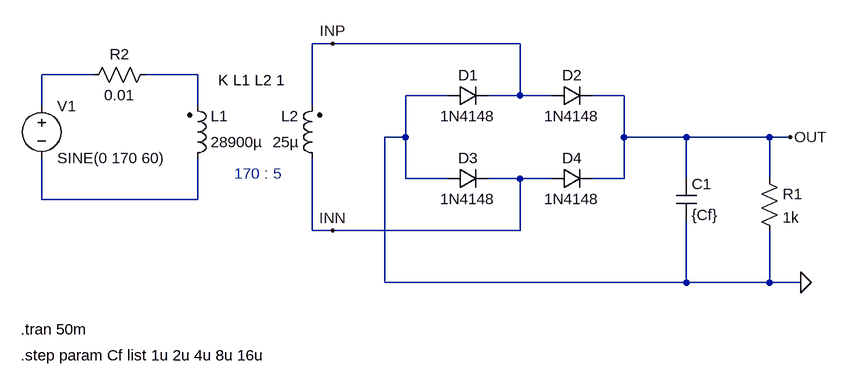
[diagram p0: schematic rectifier_fullwave_tran.asc]
rectifier_fullwave_tran.asc, the LTspice schematic file:
Version 4
SHEET 1 880 680
WIRE 64 -48 32 -48
WIRE 352 -48 64 -48
WIRE -304 0 -384 0
WIRE -144 0 -224 0
WIRE 240 32 176 32
WIRE 352 32 352 -48
WIRE 352 32 304 32
WIRE 400 32 352 32
WIRE 512 32 464 32
WIRE -384 48 -384 0
WIRE -144 48 -144 0
WIRE 32 48 32 -48
WIRE 176 96 176 32
WIRE 176 96 144 96
WIRE 512 96 512 32
WIRE 608 96 512 96
WIRE 736 96 608 96
WIRE 768 96 736 96
WIRE 176 160 176 96
WIRE 240 160 176 160
WIRE 352 160 304 160
WIRE 400 160 352 160
WIRE 512 160 512 96
WIRE 512 160 464 160
WIRE 608 160 608 96
WIRE 736 160 736 96
WIRE -384 192 -384 128
WIRE -144 192 -144 128
WIRE -144 192 -384 192
WIRE 32 240 32 128
WIRE 64 240 32 240
WIRE 352 240 352 160
WIRE 352 240 64 240
WIRE 144 320 144 96
WIRE 608 320 608 224
WIRE 608 320 144 320
WIRE 736 320 736 240
WIRE 736 320 608 320
WIRE 784 320 736 320
FLAG 784 320 0
FLAG 768 96 OUT
FLAG 64 -48 INP
FLAG 64 240 INN
SYMBOL voltage -384 32 R0
WINDOW 123 0 0 Left 0
WINDOW 39 0 0 Left 0
SYMATTR InstName V1
SYMATTR Value SINE(0 170 60)
SYMBOL diode 240 48 R270
WINDOW 0 32 32 VTop 2
WINDOW 3 0 32 VBottom 2
SYMATTR InstName D1
SYMATTR Value 1N4148
SYMBOL diode 400 48 R270
WINDOW 0 32 32 VTop 2
WINDOW 3 0 32 VBottom 2
SYMATTR InstName D2
SYMATTR Value 1N4148
SYMBOL diode 240 176 R270
WINDOW 0 32 32 VTop 2
WINDOW 3 0 32 VBottom 2
SYMATTR InstName D3
SYMATTR Value 1N4148
SYMBOL diode 400 176 R270
WINDOW 0 32 32 VTop 2
WINDOW 3 0 32 VBottom 2
SYMATTR InstName D4
SYMATTR Value 1N4148
SYMBOL ind2 -160 144 M180
WINDOW 0 36 80 Left 2
WINDOW 3 36 40 Left 2
SYMATTR InstName L1
SYMATTR Value 28900µ
SYMATTR Type ind
SYMBOL ind2 48 144 R180
WINDOW 0 36 80 Left 2
WINDOW 3 36 40 Left 2
SYMATTR InstName L2
SYMATTR Value 25µ
SYMATTR Type ind
SYMBOL res 720 144 R0
SYMATTR InstName R1
SYMATTR Value 1k
SYMBOL res -208 -16 R90
WINDOW 0 0 56 VBottom 2
WINDOW 3 32 56 VTop 2
SYMATTR InstName R2
SYMATTR Value 0.01
SYMBOL cap 592 160 R0
SYMATTR InstName C1
SYMATTR Value {Cf}
TEXT -112 8 Left 2 !K L1 L2 1
TEXT -416 392 Left 2 !.tran 50m
TEXT -88 152 Left 2 ;170 : 5
TEXT -416 432 Left 2 !.step param Cf list 1u 2u 4u 8u 16u

The netlist it stands for:
* rectifier_fullwave_tran.asc
V1 N001 N003 SINE(0 170 60)
D1 0 INP 1N4148
D2 INP OUT 1N4148
D3 0 INN 1N4148
D4 INN OUT 1N4148
L1 N003 N002 28900µ
L2 INN INP 25µ
R1 OUT 0 1k
R2 N002 N001 0.01
C1 OUT 0 {Cf}
.model D D
.lib standard.dio
K L1 L2 1
.tran 50m
* 170 : 5
.step param Cf list 1u 2u 4u 8u 16u
.backanno
.end